# EasyEDA Pro project ProProject_Smart Flower.epro

# Schematic Schematic1
Create Date: 2024-08-19; Page Name: ESP32; Project Name: Smart Flower; Schematic Name: Schematic1; Update Date: 2024-08-20; Company: EasyEDA.com; Drawn: EasyEDA; Page Size: A4; Part Number: JLCPCB-002; Reviewed: EasyEDA; Version: V0.1
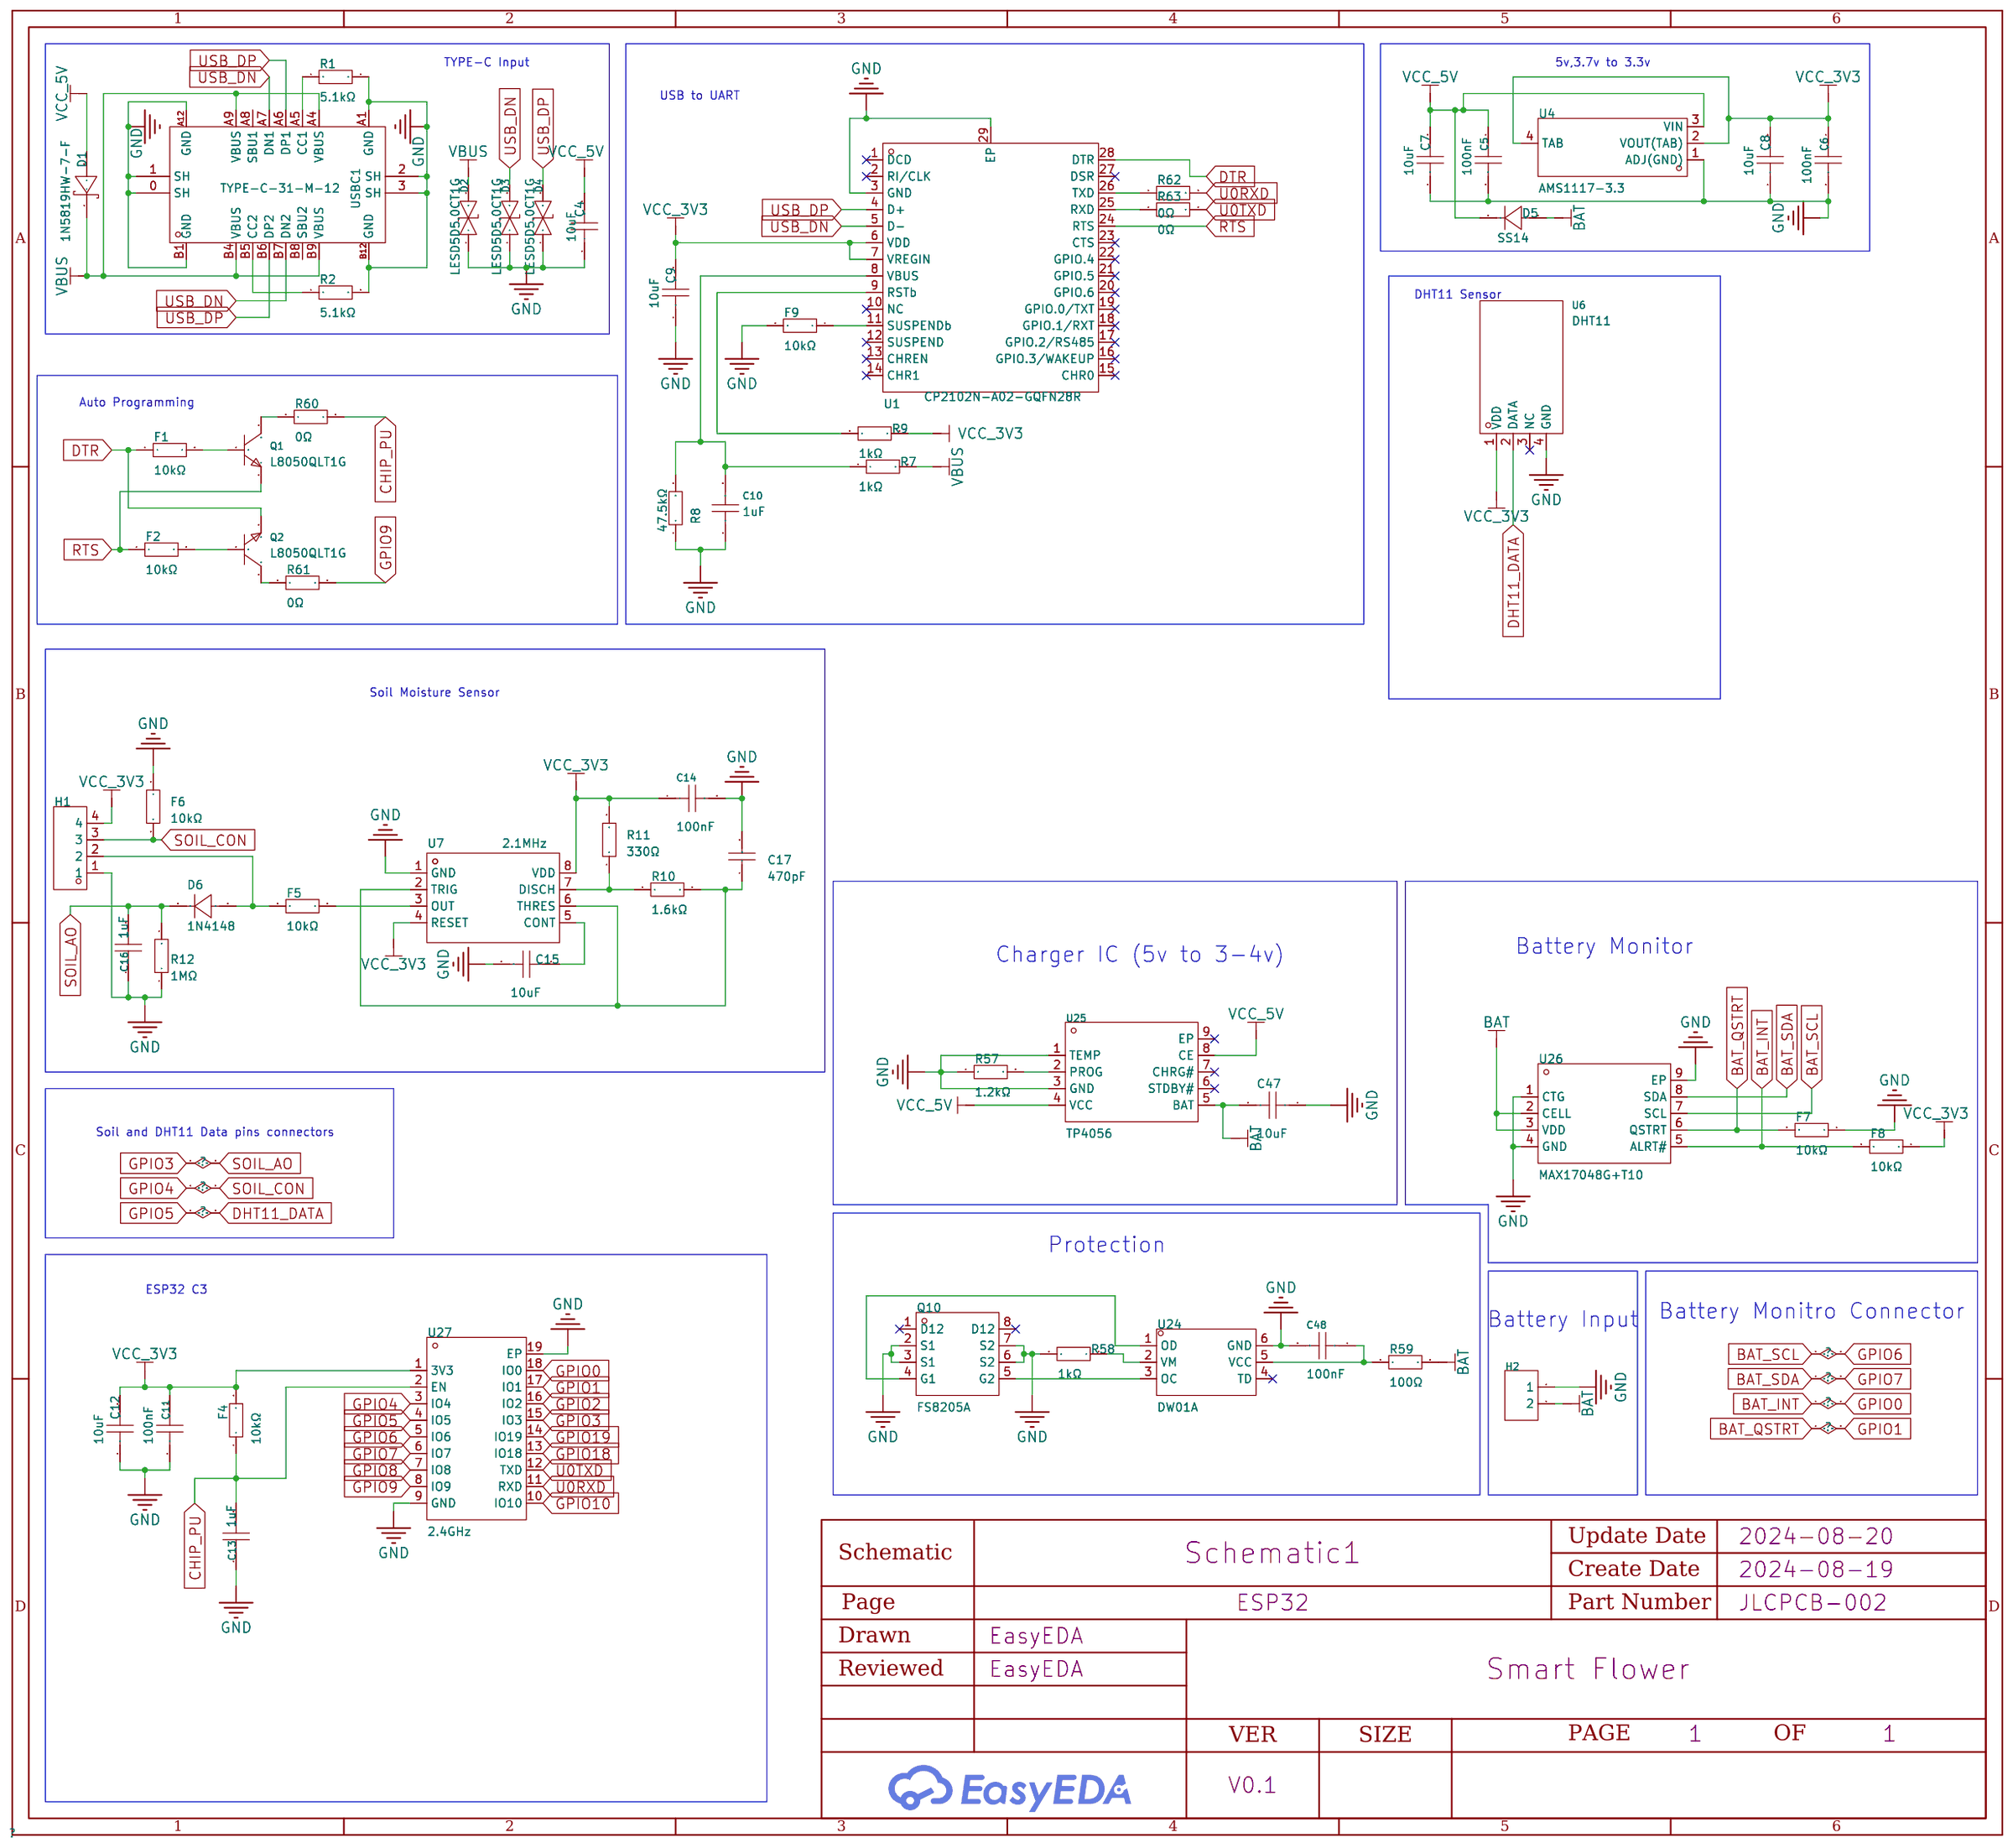
[diagram p0: schematic sheet]

## Parts
C4  10uF  [C0603]
C5  100nF  [C0805]
C6  100nF  [C0805]
C7  10uF  [C0603]
C8  10uF  [C0603]
C9  10uF  [C0603]
C10  1uF  [C0603]
C11  100nF  [C0805]
C12  10uF  [C0603]
C13  1uF  [C0603]
C14  100nF  [C0805]
C15  10uF  [C0603]
C16  1uF  [C0603]
C17  470pF  [C0603]
C47  10uF  [C0603]
C48  100nF  [C0805]
D1  1N5819HW-7-F  [SOD-123_L2.7-W1.6-LS3.7-RD]
D2  LESD5D5.0CT1G  [SOD-523_L1.2-W0.8-LS1.6-BI]
D3  LESD5D5.0CT1G  [SOD-523_L1.2-W0.8-LS1.6-BI]
D4  LESD5D5.0CT1G  [SOD-523_L1.2-W0.8-LS1.6-BI]
D5  SS14  [SMA_L4.3-W2.7-LS5.1-RD]
D6  1N4148  [DO-35_BD2.2-L4.0-D0.50_1N4148]
F1  10kΩ  [R0603]
F2  10kΩ  [R0603]
F4  10kΩ  [R0603]
F5  10kΩ  [R0603]
F6  10kΩ  [R0603]
F7  10kΩ  [R0603]
F8  10kΩ  [R0603]
F9  10kΩ  [R0603]
H1  -  [HDR-TH_4P-P2.54-V-M]  (no BOM)
H2  -  [HDR-TH_2P-P2.54-V-F]  (no BOM)
Q1  L8050QLT1G  [SOT-23-3_L2.9-W1.3-P1.90-LS2.4-BR]
Q2  L8050QLT1G  [SOT-23-3_L2.9-W1.3-P1.90-LS2.4-BR]
Q10  FS8205A  [TSSOP-8_L4.4-W3.0-P0.65-LS6.4-BL-2]  (no BOM)
R1  5.1kΩ  [R0402]
R2  5.1kΩ  [R0402]
R7  1kΩ  [R0402]
R8  47.5kΩ  [R0402]
R9  1kΩ  [R0603]
R10  1.6kΩ  [R0402]
R11  330Ω  [R0603]
R12  1MΩ  [R0603]
R57  1.2kΩ  [R0402]
R58  1kΩ  [R0603]
R59  100Ω  [R0603]
R60  0Ω  [R0402]
R61  0Ω  [R0402]
R62  0Ω  [R0402]
R63  0Ω  [R0402]
U1  CP2102N-A02-GQFN28R  [QFN-28_L5.0-W5.0-P0.50-TL-EP3.3]
U4  AMS1117-3.3  [SOT-223-4_L6.5-W3.5-P2.30-LS7.0-BR]
U6  DHT11  [SENSOR-TH_DHT11]
U7  2.1MHz  [SOIC-8_L5.0-W4.0-P1.27-LS6.0-BL]
U24  DW01A  [SOT-23-6_L2.9-W1.6-P0.95-LS2.8-BL]
U25  TP4056  [ESOP-8_L4.9-W3.9-P1.27-LS6.0-BL-EP]
U26  MAX17048G+T10  [DFN-8_L2.0-W2.0-P0.50-BL-EP]
U27  2.4GHz  [BULETM-SMD_ESPRESSIF_ESP32-C3-WROOM-02-N4-4MB]
USBC1  TYPE-C-31-M-12  [USB-C_SMD-TYPE-C-31-M-12]

## Library data of the parts
C4 C7-C9 C12 C15 C47 = CL10A106MA8NRNC: Capacitance: Tolerance:±20% Tolerance:±20% Voltage Rated: Temperature Coefficient:; LCSC Part Name: 10uF ±20% 25V; Supplier Part: C96446; Manufacturer: SAMSUNG(三星); Supplier Footprint: 0603; JLCPCB Part Class: Basic Part; Datasheet: https://atta.szlcsc.com/upload/public/pdf/source/20160218/1457707763339.pdf; Supplier: LCSC; Tolerance: ±20%
C5 C6 C11 C14 C48 = CL21B104KCFNNNE: Capacitance: Tolerance:±10% Tolerance:±10% Voltage Rated: Temperature Coefficient:; LCSC Part Name: 100nF ±10% 100V; Supplier Part: C28233; Manufacturer: SAMSUNG(三星); Supplier Footprint: 0805; JLCPCB Part Class: Basic Part; Datasheet: https://atta.szlcsc.com/upload/public/pdf/source/20160218/1457707763339.pdf; Supplier: LCSC; Tolerance: ±10%
C10 C13 C16 = CL10A105KB8NNNC: Capacitance: Tolerance:±10% Tolerance:±10% Voltage Rated: Temperature Coefficient:; LCSC Part Name: 1uF ±10% 50V; Supplier Part: C15849; Manufacturer: SAMSUNG(三星); Supplier Footprint: 0603; JLCPCB Part Class: Basic Part; Datasheet: https://atta.szlcsc.com/upload/public/pdf/source/20160218/1457707763339.pdf; Supplier: LCSC; Tolerance: ±10%
C17 = 0603B471K500NT: Capacitance: Tolerance:±10% Tolerance:±10% Voltage Rated: Temperature Coefficient:; LCSC Part Name: 470pF ±10% 50V; Supplier Part: C1620; Manufacturer: FH(风华); Supplier Footprint: 0603; JLCPCB Part Class: Basic Part; Datasheet: https://atta.szlcsc.com/upload/public/pdf/source/20200305/C486355_26A10D38EF8C2A5C37091D0039909270.pdf; Supplier: LCSC; Tolerance: ±10%
D1 = 1N5819HW-7-F: Forward Voltage (Vf@If):450mV@1A Reverse Voltage (Vr):40V Average Rectified Current (Io):1A Reverse Leakage Current (Ir):1mA@40V; LCSC Part Name: 电压:40V 电流:1A; Supplier Part: C82544; Manufacturer: DIODES(美台); Supplier Footprint: SOD-123; JLCPCB Part Class: Extended Part; Datasheet: https://atta.szlcsc.com/upload/public/pdf/source/20161024/1477288459223.pdf; Supplier: LCSC; Forward Voltage (Vf@If): 450mV@1A; Reverse Voltage (Vr): 40V; Average Rectified Current (Io): 1A; Reverse Leakage Current (Ir): 1mA@40V
D2-D4 = LESD5D5.0CT1G: polarity:Bi-Directional Reverse Stand-Off Voltage (Vrwm):5V Maximum Clamping Voltage:18.6V Peak Pulse Current (Ipp)@10/1000us:9.4A Breakdown Voltage:5.6V Type:ESD; LCSC Part Name: 双向ESD; Supplier Part: C383211; Manufacturer: LRC(乐山无线电); Supplier Footprint: SOD-523; JLCPCB Part Class: Extended Part; Datasheet: https://atta.szlcsc.com/upload/public/pdf/source/20190807/C383211_633DF4B4E2C161403226E5235FE33A1C.pdf; Supplier: LCSC; polarity: Bi-Directional; Reverse Stand-Off Voltage (Vrwm): 5V; Maximum Clamping Voltage: 18.6V; Peak Pulse Current (Ipp)@10/1000us: 9.4A; Breakdown Voltage: 5.6V; Type: ESD
D5 = SS14_C2480: Diode Configuration:Single Forward Voltage (Vf@If):550mV@1A Reverse Voltage (Vr):40V Rectified Current:1A Reverse Leakage Current (Ir):300uA@40V; LCSC Part Name: 电压:40V 电流:1A; Supplier Part: C2480; Manufacturer: MDD(辰达半导体); Supplier Footprint: SMA(DO-214AC); JLCPCB Part Class: Basic Part; Datasheet: https://atta.szlcsc.com/upload/public/pdf/source/20230712/2DB6064CFBB99DE6DB116BEE8208BE66.pdf; Supplier: LCSC; Diode Configuration: Single; Forward Voltage (Vf@If): 550mV@1A; Reverse Voltage (Vr): 40V; Rectified Current: 1A; Reverse Leakage Current (Ir): 300uA@40V; Average Rectified Current (Io): 1A; Peak forward surge current: 30A
D6 = 1N4148_C18195411: Supplier Part: C18195411; Manufacturer: LJ(朗捷); Supplier Footprint: DO-35; JLCPCB Part Class: Extended Part; Datasheet: https://atta.szlcsc.com/upload/public/pdf/source/20230921/E18EF32AEA6D96127C0687F4453A915D.pdf; Supplier: LCSC
F1 F2 F4-F9 = 0603WAF1002T5E: Type:Thick Film Resistors Resistance:10kΩ Tolerance:±1% Tolerance:±1% Power(Watts): Overload Voltage (Max): Temperature Coefficient:±100ppm/℃ Temperature Coefficient:±100ppm/℃ Operating Temperature Range:-55℃~+155℃ Operating Temperature Range:-55℃~+155℃; LCSC Part Name: 厚膜电阻 10kΩ ±1% 100mW; Supplier Part: C25804; Manufacturer: UNI-ROYAL(厚声); Supplier Footprint: 0603; JLCPCB Part Class: Basic Part; Datasheet: https://atta.szlcsc.com/upload/public/pdf/source/20200306/C422600_1E6D84923E4A46A82E41ADD87F860B5C.pdf; Supplier: LCSC; Type: Thick Film Resistors; Tolerance: ±1%; Temperature Coefficient: ±100ppm/℃; Operating Temperature Range: -55℃~+155℃
H1 = HDR-M_2.54_1x4P: Supplier Footprint: Through
H2 = HDR-F_2.54_1x2P: Supplier Footprint: Through
Q1 Q2 = L8050QLT1G: Transistor Type: Collector Current (Ic): Collector-Emitter Breakdown Voltage (Vceo): Power Dissipation (Pd):; LCSC Part Name: 耐压:25V 电流:800mA NPN; Supplier Part: C49581; Manufacturer: LRC(乐山无线电); Supplier Footprint: SOT-23; JLCPCB Part Class: Extended Part; Datasheet: https://atta.szlcsc.com/upload/public/pdf/source/20150518/1457707314424.pdf; Supplier: LCSC
Q10 = FS8205A_C16052: Type:2 N-Channel Drain Source Voltage (Vdss): Continuous Drain Current (Id): Power Dissipation (Pd): Drain Source On Resistance (RDS(on)@Vgs,Id):25mΩ@4.5V,4A Gate Threshold Voltage (Vgs(th)@Id):1V@250uA; LCSC Part Name: 2个N沟道 耐压:20V 电流:6A; Supplier Part: C16052; Manufacturer: FORTUNE(富晶); Supplier Footprint: TSSOP-8; JLCPCB Part Class: Extended Part; Datasheet: https://atta.szlcsc.com/upload/public/pdf/source/20140228/1457706997167.pdf; Supplier: LCSC; Type: 2 N-Channel; Drain Source On Resistance (RDS(on)@Vgs,Id): 25mΩ@4.5V,4A; Gate Threshold Voltage (Vgs(th)@Id): 1V@250uA
R1 R2 = 0402WGF5101TCE: Type:Thick Film Resistors Resistance:5.1kΩ Tolerance:±1% Tolerance:±1% Power(Watts): Overload Voltage (Max): Temperature Coefficient:±100ppm/℃ Temperature Coefficient:±100ppm/℃ Operating Temperature Range:-55℃~+155℃ Operating Temperature Range:-55℃~+155℃; LCSC Part Name: 5.1kΩ ±1% 62.5mW 厚膜电阻; Supplier Part: C25905; Manufacturer: UNI-ROYAL(厚声); Supplier Footprint: 0402; JLCPCB Part Class: Basic Part; Datasheet: https://atta.szlcsc.com/upload/public/pdf/source/20200306/C422600_1E6D84923E4A46A82E41ADD87F860B5C.pdf; Supplier: LCSC; Type: Thick Film Resistors; Tolerance: ±1%; Temperature Coefficient: ±100ppm/℃; Operating Temperature Range: -55℃~+155℃
R7 = 0402WGF1001TCE: Type:Thick Film Resistors Resistance:1kΩ Tolerance:±1% Tolerance:±1% Power(Watts): Overload Voltage (Max): Temperature Coefficient:±100ppm/℃ Temperature Coefficient:±100ppm/℃ Operating Temperature Range:-55℃~+155℃ Operating Temperature Range:-55℃~+155℃; LCSC Part Name: 1kΩ ±1% 62.5mW 厚膜电阻; Supplier Part: C11702; Manufacturer: UNI-ROYAL(厚声); Supplier Footprint: 0402; JLCPCB Part Class: Basic Part; Datasheet: https://atta.szlcsc.com/upload/public/pdf/source/20200306/C422600_1E6D84923E4A46A82E41ADD87F860B5C.pdf; Supplier: LCSC; Type: Thick Film Resistors; Tolerance: ±1%; Temperature Coefficient: ±100ppm/℃; Operating Temperature Range: -55℃~+155℃
R8 = AR02DTD4752: Type:Thin Film Resistor Resistance: Tolerance:±0.5% Tolerance:±0.5% Power(Watts): Overload Voltage (Max): Temperature Coefficient:±50ppm/℃ Temperature Coefficient:±50ppm/℃ Operating Temperature Range:-55℃~+155℃ Operating Temperature Range:-55℃~+155℃; LCSC Part Name: 薄膜电阻 47.5kΩ ±0.5% 62.5mW; Supplier Part: C319604; Manufacturer: Viking(光颉); Supplier Footprint: 0402; JLCPCB Part Class: Extended Part; Datasheet: https://atta.szlcsc.com/upload/public/pdf/source/20191129/C465721_10D49275DB41E427863CE9C8D788770A.pdf; Supplier: LCSC; Type: Thin Film Resistor; Tolerance: ±0.5%; Temperature Coefficient: ±50ppm/℃; Operating Temperature Range: -55℃~+155℃
R9 R58 = 0603WAF1001T5E: Type:Thick Film Resistors Resistance:1kΩ Tolerance:±1% Tolerance:±1% Power(Watts): Overload Voltage (Max): Temperature Coefficient:±100ppm/℃ Temperature Coefficient:±100ppm/℃ Operating Temperature Range:-55℃~+155℃ Operating Temperature Range:-55℃~+155℃; LCSC Part Name: 1kΩ ±1% 100mW 厚膜电阻; Supplier Part: C21190; Manufacturer: UNI-ROYAL(厚声); Supplier Footprint: 0603; JLCPCB Part Class: Basic Part; Datasheet: https://atta.szlcsc.com/upload/public/pdf/source/20200306/C422600_1E6D84923E4A46A82E41ADD87F860B5C.pdf; Supplier: LCSC; Type: Thick Film Resistors; Tolerance: ±1%; Temperature Coefficient: ±100ppm/℃; Operating Temperature Range: -55℃~+155℃
R10 = RTT02162JTH: Type:Thick Film Resistors Resistance: Tolerance:±5% Tolerance:±5% Power(Watts): Overload Voltage (Max): Temperature Coefficient:±100ppm/℃ Temperature Coefficient:±100ppm/℃ Operating Temperature Range:-55℃~+155℃ Operating Temperature Range:-55℃~+155℃; LCSC Part Name: 厚膜电阻 1.6kΩ ±5% 62.5mW; Supplier Part: C102832; Manufacturer: RALEC(旺诠); Supplier Footprint: 0402; JLCPCB Part Class: Extended Part; Datasheet: https://atta.szlcsc.com/upload/public/pdf/source/20191219/C158410_884373A5B7E1BC76BF57BC45A946C093.pdf; Supplier: LCSC; Type: Thick Film Resistors; Tolerance: ±5%; Temperature Coefficient: ±100ppm/℃; Operating Temperature Range: -55℃~+155℃
R11 = 0603WAF3300T5E: Type:Thick Film Resistors Resistance: Tolerance:±1% Tolerance:±1% Power(Watts): Overload Voltage (Max): Temperature Coefficient:±100ppm/℃ Temperature Coefficient:±100ppm/℃ Operating Temperature Range:-55℃~+155℃ Operating Temperature Range:-55℃~+155℃; LCSC Part Name: 330Ω ±1% 100mW 厚膜电阻; Supplier Part: C23138; Manufacturer: UNI-ROYAL(厚声); Supplier Footprint: 0603; JLCPCB Part Class: Basic Part; Datasheet: https://atta.szlcsc.com/upload/public/pdf/source/20200306/C422600_1E6D84923E4A46A82E41ADD87F860B5C.pdf; Supplier: LCSC; Type: Thick Film Resistors; Tolerance: ±1%; Temperature Coefficient: ±100ppm/℃; Operating Temperature Range: -55℃~+155℃
R12 = 0603WAF1004T5E: Type:Thick Film Resistors Resistance:1MΩ Tolerance:±1% Tolerance:±1% Power(Watts): Overload Voltage (Max): Temperature Coefficient:±100ppm/℃ Temperature Coefficient:±100ppm/℃ Operating Temperature Range:-55℃~+155℃ Operating Temperature Range:-55℃~+155℃; LCSC Part Name: 1MΩ ±1% 100mW 厚膜电阻; Supplier Part: C22935; Manufacturer: UNI-ROYAL(厚声); Supplier Footprint: 0603; JLCPCB Part Class: Basic Part; Datasheet: https://atta.szlcsc.com/upload/public/pdf/source/20200306/C422600_1E6D84923E4A46A82E41ADD87F860B5C.pdf; Supplier: LCSC; Type: Thick Film Resistors; Tolerance: ±1%; Temperature Coefficient: ±100ppm/℃; Operating Temperature Range: -55℃~+155℃
R57 = RC0402FR-071K2L: Type:Thick Film Resistors Resistance: Tolerance:±1% Tolerance:±1% Power(Watts): Overload Voltage (Max): Temperature Coefficient:±100ppm/℃ Temperature Coefficient:±100ppm/℃ Operating Temperature Range:-55℃~+155℃ Operating Temperature Range:-55℃~+155℃; LCSC Part Name: 厚膜电阻 1.2kΩ ±1% 62.5mW; Supplier Part: C138040; Manufacturer: YAGEO(国巨); Supplier Footprint: 0402; JLCPCB Part Class: Extended Part; Datasheet: https://atta.szlcsc.com/upload/public/pdf/source/20181009/C309620_DA5935B6E1D48212CB7A533FE518B3C2.pdf; Supplier: LCSC; Type: Thick Film Resistors; Tolerance: ±1%; Temperature Coefficient: ±100ppm/℃; Operating Temperature Range: -55℃~+155℃
R59 = 0603WAF1000T5E: Type:Thick Film Resistors Resistance: Tolerance:±1% Tolerance:±1% Power(Watts): Overload Voltage (Max): Temperature Coefficient:±200ppm/℃ Temperature Coefficient:±200ppm/℃ Operating Temperature Range:-55℃~+155℃ Operating Temperature Range:-55℃~+155℃; LCSC Part Name: 100Ω ±1% 100mW 厚膜电阻; Supplier Part: C22775; Manufacturer: UNI-ROYAL(厚声); Supplier Footprint: 0603; JLCPCB Part Class: Basic Part; Datasheet: https://atta.szlcsc.com/upload/public/pdf/source/20200306/C422600_1E6D84923E4A46A82E41ADD87F860B5C.pdf; Supplier: LCSC; Type: Thick Film Resistors; Tolerance: ±1%; Temperature Coefficient: ±200ppm/℃; Operating Temperature Range: -55℃~+155℃
R60-R63 = 0402WGF0000TCE: Type:Thick Film Resistors Resistance: Tolerance:±1% Tolerance:±1% Power(Watts): Overload Voltage (Max): Temperature Coefficient:±800ppm/℃ Temperature Coefficient:±800ppm/℃ Operating Temperature Range:-55℃~+155℃ Operating Temperature Range:-55℃~+155℃; LCSC Part Name: 0Ω ±1% 62.5mW 厚膜电阻; Supplier Part: C17168; Manufacturer: UNI-ROYAL(厚声); Supplier Footprint: 0402; JLCPCB Part Class: Basic Part; Datasheet: https://atta.szlcsc.com/upload/public/pdf/source/20200306/C422600_1E6D84923E4A46A82E41ADD87F860B5C.pdf; Supplier: LCSC; Type: Thick Film Resistors; Tolerance: ±1%; Temperature Coefficient: ±800ppm/℃; Operating Temperature Range: -55℃~+155℃
U1 = CP2102N-A02-GQFN28R: Applications Function:USB转UART Protocol:UART Supply Voltage:3V~3.6V Supply Voltage:3V~3.6V Operating Temperature:-40℃~+85℃@(Ta) Operating Temperature:-40℃~+85℃@(Ta); LCSC Part Name: USB 2.0全速功能控制器，USB收发器，振荡器和通用异步接收机/发射机(UART); Supplier Part: C964632; Manufacturer: SKYWORKS/SILICON LABS(芯科); Supplier Footprint: QFN-28-EP(5x5); JLCPCB Part Class: Extended Part; Datasheet: https://atta.szlcsc.com/upload/public/pdf/source/20201204/C964632_F2B790CC23A72455AEF523510305B30A.pdf; Supplier: LCSC; Applications Function: USB转UART; Protocol: UART; Supply Voltage: 3V~3.6V; Operating Temperature: -40℃~+85℃@(Ta)
U4 = AMS1117-3.3_C6186: Output Type: Maximum Input Voltage:- Output Voltage:3.3V Output Voltage:3.3V MAX Output Current:1A Power Supply Rejection Ratio (PSRR):72dB@(120Hz) Dropout Voltage:1.3V@(800mA) standby current:- Noise:- Feature:- Operating Temperature:- Operating Temperat; LCSC Part Name: 输出3.3V 1A; Supplier Part: C6186; Manufacturer: AMS; Supplier Footprint: SOT-223; JLCPCB Part Class: Basic Part; Datasheet: https://atta.szlcsc.com/upload/public/pdf/source/20180727/C6186_7A095716F0823C02F1997A905E26C086.pdf; Supplier: LCSC; Output Voltage: 3.3V; MAX Output Current: 1A; Power Supply Rejection Ratio (PSRR): 72dB@(120Hz); Dropout Voltage: 1.3V@(800mA); Output Polarity: Positive electrode; Number of Outputs: 1
U6 = DHT11_C117051: LCSC Part Name: DHT11  电容式传感器; Supplier Part: C117051; Manufacturer: 广州奥松; Supplier Footprint: SIP-4; JLCPCB Part Class: Extended Part; Datasheet: https://atta.szlcsc.com/upload/public/pdf/source/20170703/1499081238365.pdf; Supplier: LCSC
U7 = TLC555CDR: Frequency:2.1MHz Supply Voltage:2V~15V Supply Voltage:2V~15V Supply Current:360uA Operating Temperature:0℃~+70℃ Operating Temperature:0℃~+70℃; Supplier Part: C6986; Manufacturer: TI(德州仪器); Supplier Footprint: SOIC-8; JLCPCB Part Class: Extended Part; Datasheet: https://www.ti.com/cn/lit/gpn/tlc555; Supplier: LCSC; Supply Voltage: 2V~15V; Supply Current: 360uA; Operating Temperature: 0℃~+70℃
U24 = DW01A_C351410: Supplier Part: C351410; Manufacturer: PUOLOP(迪浦); Supplier Footprint: SOT-23-6L; JLCPCB Part Class: Extended Part; Datasheet: https://atta.szlcsc.com/upload/public/pdf/source/20190109/C351410_3E9B9491D1909DF24C48D1B9CD871392.pdf; Supplier: LCSC
U25 = TP4056_C382139: LCSC Part Name: 1A锂电池充电IC; Supplier Part: C382139; Manufacturer: TPOWER(天源); Supplier Footprint: ESOP-8; JLCPCB Part Class: Extended Part; Datasheet: https://atta.szlcsc.com/upload/public/pdf/source/20190327/C382139_EC85960E6FE3E26856C240C81751A184.pdf; Supplier: LCSC
U26 = MAX17048G+T10: The Chip Type:电池监测芯片 Type of Battery:锂离子/Polymer Number of Cells:1 Number of Cells:1 Operating Temperature:-20℃~+70℃ Operating Temperature:-20℃~+70℃; Supplier Part: C2682616; Manufacturer: ADI(亚德诺)/MAXIM(美信); Supplier Footprint: DFN-8-EP(2x2); JLCPCB Part Class: Extended Part; Datasheet: https://atta.szlcsc.com/upload/public/pdf/source/20210106/C2682616_818568B5D3BA4B627110FCAA33E0BFB1.pdf; Supplier: LCSC; The Chip Type: 电池监测芯片; Type of Battery: 锂离子/Polymer; Number of Cells: 1; Operating Temperature: -20℃~+70℃
U27 = ESP32-C3-WROOM-02-N4_C2934560: Core Processor:ESP32-C3芯片 Support Interface:I2C；GPIO；SPI；JTAG；UART；USB；I2S Frequency:2.4GHz Output Power:20.5dBm Output Power:20.5dBm; LCSC Part Name: ESP32-C3-WROOM-02-N4; Supplier Part: C2934560; Manufacturer: ESPRESSIF(乐鑫); Manufacturer Part: ESP32-C3-WROOM-02-N4; Supplier Footprint: VFQFN-32-EP; JLCPCB Part Class: Extended Part; Datasheet: https://atta.szlcsc.com/upload/public/pdf/source/20220106/F07459EFFE1D7CBA94B4FB8A075146A6.pdf; Supplier: LCSC; Core Processor: ESP32-C3芯片; Support Interface: I2C；GPIO；SPI；JTAG；UART；USB；I2S; Output Power: 20.5dBm
USBC1 = TYPE-C-31-M-12: Connector Type:Type-C Standard:- Gender:Female Number of Ports:1 Number of Contacts:16P Mounting Style:- Current Rating - Power (Max):5A Contact Material:- Contact Plating:- Operating Temperature Range:- Operating Temperature Range:- Soldering Temperature; LCSC Part Name: Type-C 母; Supplier Part: C165948; Manufacturer: 韩国韩荣; Supplier Footprint: SMD; JLCPCB Part Class: Extended Part; Datasheet: https://atta.szlcsc.com/upload/public/pdf/source/20220525/466408E853115E789EDB0DDC29077C05.pdf; Supplier: LCSC; Connector Type: Type-C; Gender: Female; Number of Ports: 1; Number of Contacts: 16P; Current Rating - Power (Max): 5A

## Nets
GND: C4.1 C5.2 C6.2 C7.1 C8.1 C9.1 C10.1 C11.2 C12.1 C13.1 C14.2 C15.2 C16.1 C17.2 C47.1 C48.2 D2.1 D3.1 D4.1 F6.1 F7.1 F9.2 H1.1 H2.1 Q10.2(S1) Q10.3(S1) Q10.6(S2) Q10.7(S2) R1.2 R2.2 R8.1 R12.1 R57.1 R58.2 U1.3(GND) U1.29(EP) U4.1(ADJ(GND)) U6.4(GND) U7.1(GND) U24.6(GND) U25.1(TEMP) U25.3(GND) U26.1(CTG) U26.4(GND) U26.9(EP) U27.9(GND) U27.19(EP) USBC1.0(SH) USBC1.1(SH) USBC1.2(SH) USBC1.3(SH) USBC1.A1(GND) USBC1.A12(GND) USBC1.B1(GND) USBC1.B12(GND)
VBUS: D1.1(K) D2.2 R7.2 USBC1.A4(VBUS) USBC1.A9(VBUS) USBC1.B4(VBUS) USBC1.B9(VBUS)
VCC_3V3: C6.1 C8.2 C9.2 C11.1 C12.2 C14.1 F4.2 F8.1 H1.4 R9.1 R11.2 U1.6(VDD) U1.7(VREGIN) U4.2(VOUT(TAB)) U4.4(TAB) U6.1(VDD) U7.4(RESET) U7.8(VDD) U27.1(3V3)
VCC_5V: C4.2 C5.1 C7.2 D1.2(A) D5.1(K) U4.3(VIN) U25.4(VCC) U25.8(CE)
BAT: C47.2 D5.2(A) H2.2 R59.2 U25.5(BAT) U26.2(CELL) U26.3(VDD)
BAT_INT: F8.2 U26.5(ALRT#) U27.18(IO0)
BAT_QSTRT: F7.2 U26.6(QSTRT) U27.17(IO1)
BAT_SCL: U26.7(SCL) U27.5(IO6)
BAT_SDA: U26.8(SDA) U27.6(IO7)
CHIP_PU: C13.2 F4.1 R60.2 U27.2(EN)
DHT11_DATA: U6.2(DATA) U27.4(IO5)
DTR: F1.1 Q2.2(E) U1.28(DTR)
GPIO2: U27.16(IO2)
GPIO3: C16.2 D6.2(C) R12.2 U27.15(IO3)
GPIO4: F6.2 H1.3 U27.3(IO4)
GPIO8: U27.7(IO8)
GPIO9: R61.2 U27.8(IO9)
GPIO10: U27.10(IO10)
GPIO18: U27.13(IO18)
GPIO19: U27.14(IO19)
RTS: F2.1 Q1.2(E) U1.24(RTS)
U0RXD: R62.2 U27.11(RXD)
U0TXD: R63.2 U27.12(TXD)
USB_DN: D3.2 U1.5(D-) USBC1.A7(DN1) USBC1.B7(DN2)
USB_DP: D4.2 U1.4(D+) USBC1.A6(DP1) USBC1.B6(DP2)
$1N9728: R2.1 USBC1.B5(CC2)
$1N9740: R1.1 USBC1.A5(CC1)
$1N10217: Q1.3(C) R60.1
$1N10218: Q2.3(C) R61.1
$1N10219: F1.2 Q1.1(B)
$1N10220: F2.2 Q2.1(B)
$1N12006: R63.1 U1.25(RXD)
$1N12008: R62.1 U1.26(TXD)
$1N12116: F9.1 U1.11(SUSPENDb)
$1N12546: R9.2 U1.9(RSTb)
$1N16421: C15.1 U7.5(CONT)
$1N16436: R10.1 R11.1 U7.7(DISCH)
$1N16545: F5.1 U7.3(OUT)
$1N16696: D6.1(A) F5.2 H1.2
$1N16851: C17.1 R10.2 U7.2(TRIG) U7.6(THRES)
$1N49000: R57.2 U25.2(PROG)
$1N49009: C48.1 R59.1 U24.5(VCC)
$1N49011: Q10.5(G2) U24.3(OC)
$1N49012: Q10.4(G1) U24.1(OD)
$1N49015: R58.1 U24.2(VM)
Net-(C10-2): C10.2 R7.1 R8.2 U1.8(VBUS)

Not connected (* = marked no-connect by the designer): Q10 1(D12)* 8(D12)*; U1 1(DCD)* 2(RI/CLK)* 10(NC)* 12(SUSPEND)* 13(CHREN)* 14(CHR1)* 15(CHR0)* 16(GPIO.3/WAKEUP)* 17(GPIO.2/RS485)* 18(GPIO.1/RXT)* 19(GPIO.0/TXT)* 20(GPIO.6)* 21(GPIO.5)* 22(GPIO.4)* 23(CTS)* 27(DSR)*; U6 3(NC)*; U24 4(TD)*; U25 6(STDBY#)* 7(CHRG#)* 9(EP)*; USBC1 A8(SBU1) B8(SBU2)

## Notes on the sheet
- TYPE-C Input
- 5v,3.7v to 3.3v
- USB to UART
- DHT11 Sensor
- Auto Programming
- Soil Moisture Sensor
- Charger IC (5v to 3-4v)
- Battery Monitor
- Soil and DHT11 Data pins connectors
- Protection
- ESP32 C3
- Battery Monitro Connector
- Battery Input

# Board PCB19
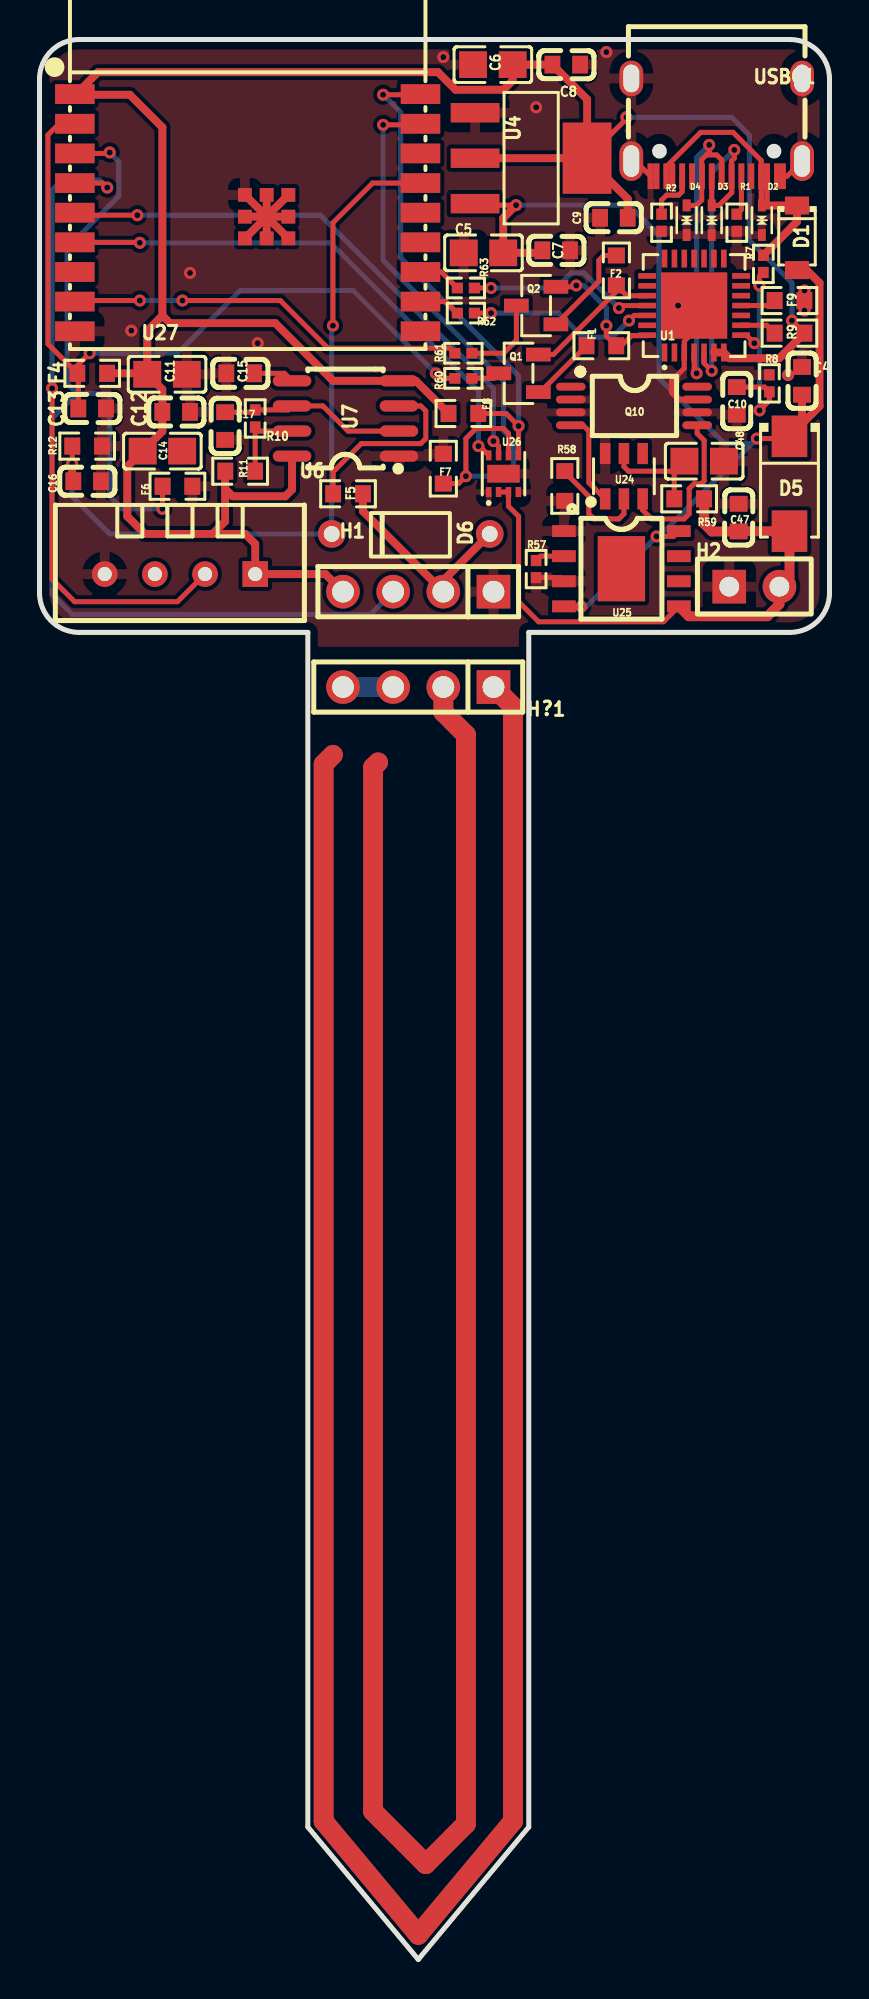
[diagram p1: board, top side]
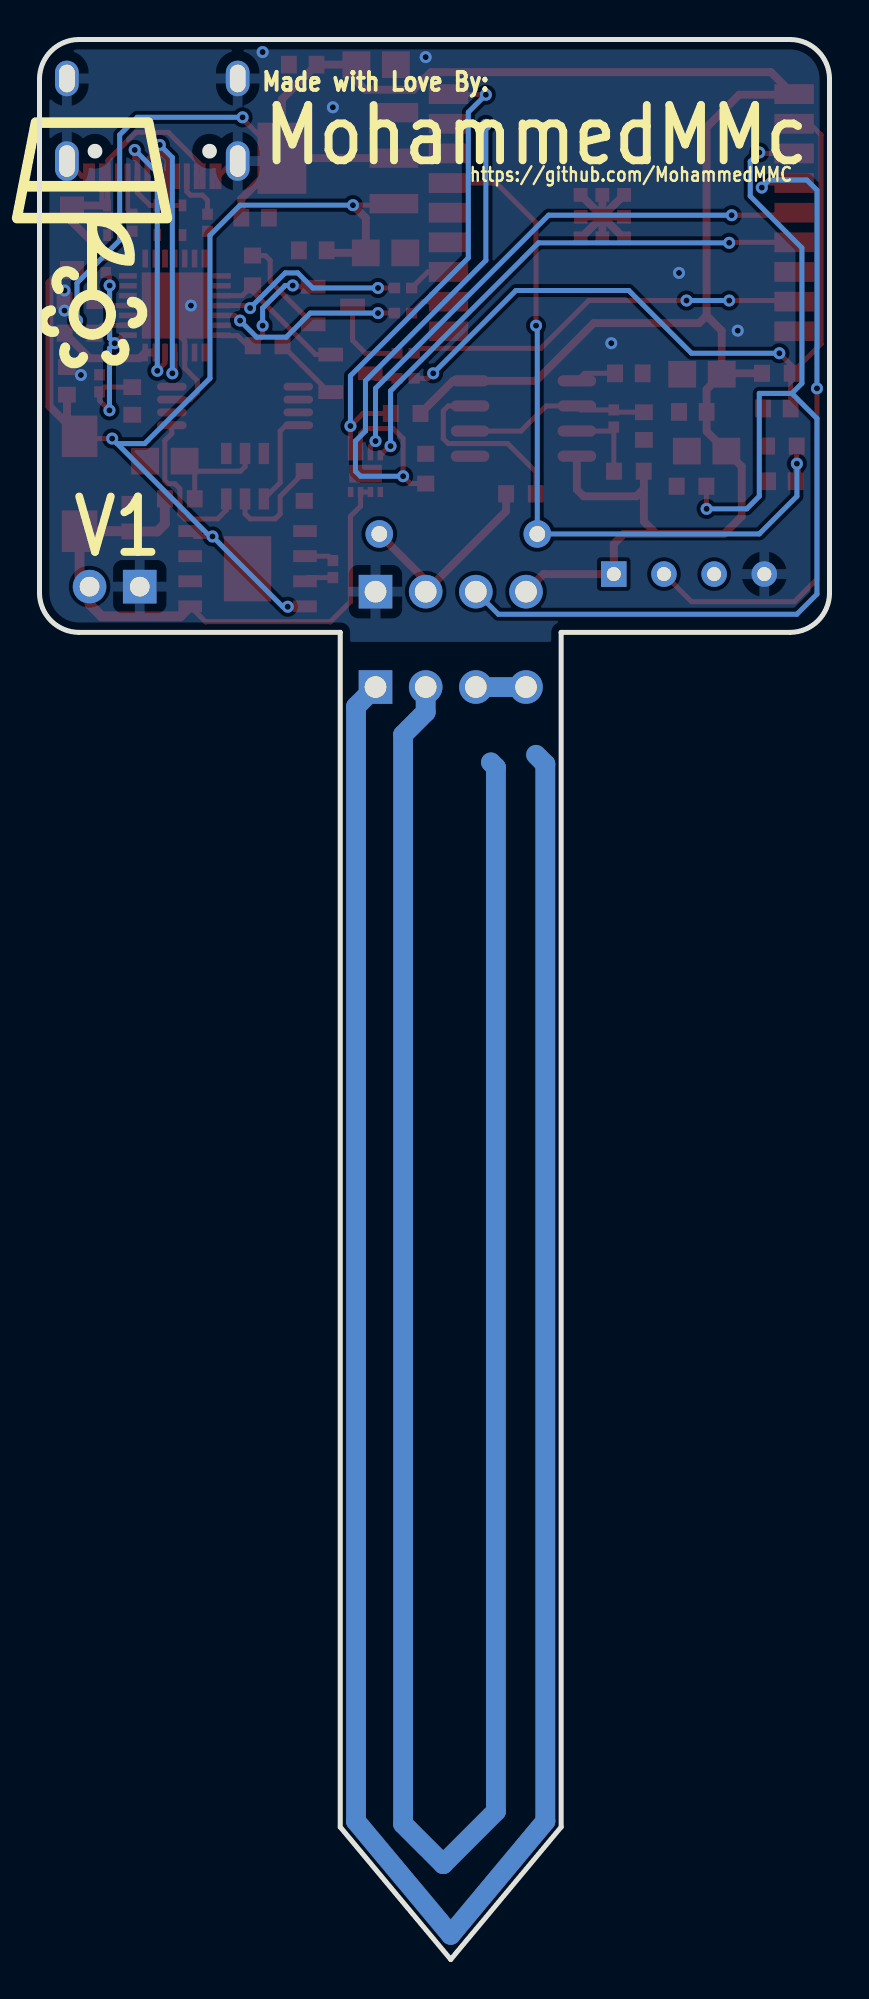
[diagram p2: board, bottom side, seen from below]

Outline 40 x 97.16 mm; copper layers: Top Layer, Bottom Layer. Coordinates in mm from the lower left corner of the outline.
Outline path: 0,95.16 0,69.15 arc(0.59,67.74) 2,67.15 13.59,67.15 13.59,6.7 19.18,0 24.77,6.7 24.77,67.15 38,67.15 arc(39.41,67.74) 40,69.15 40,95.16 arc(39.41,96.57) 38,97.16 2,97.16 arc(0.59,96.57) 0,95.16
Stack: Top Layer 0.035mm / Dielectric1 1.51mm FR4 er 4.5 / Bottom Layer 0.035mm

## Design rules (mm)
template: JLCPCB Capability(Two Layers Board)
spacing copperThickness1oz (default): track to track 0.102, other pairs 0.152 to 0.3
spacing copperThickness2oz: track to track 0.203, other pairs 0.152 to 0.3
track width copperThickness1oz (default): min 0.127, default 0.254, max 2.54
track width copperThickness2oz: min 0.203, default 0.254, max 2.54
differential pair differentialPair (default): width min 0.127, default 0.254, max 2.54; gap min 0.152, default 0.152
via viaSize (default): diameter min 0.5, default 0.61, max 10; hole min 0.3, default 0.305, max 6.3

## Placement (name value [footprint] x y rotation side)
C4  10uF  [C0603]  38.61 79.88 270 top
C5  100nF  [C0805]  22.48 86.36 180 top
C6  100nF  [C0805]  22.95 95.88 180 top
C7  10uF  [C0603]  26.16 86.49 180 top
C8  10uF  [C0603]  26.67 95.88 180 top
C9  10uF  [C0603]  29.08 88.14 0 top
C10  1uF  [C0603]  35.31 78.87 90 top
C11  100nF  [C0805]  6.46 80.21 0 top
C12  10uF  [C0603]  6.92 78.31 180 top
C13  1uF  [C0603]  2.67 78.49 180 top
C14  100nF  [C0805]  6.22 76.33 0 top
C15  10uF  [C0603]  10.16 80.26 180 top
C16  1uF  [C0603]  2.41 74.8 180 top
C17  470pF  [C0603]  9.4 77.6 270 top
C47  10uF  [C0603]  35.4 72.96 270 top
C48  100nF  [C0805]  33.66 75.82 0 top
D1  1N5819HW-7-F  [SOD-123_L2.7-W1.6-LS3.7-RD]  38.35 87.12 270 top
D2  LESD5D5.0CT1G  [SOD-523_L1.2-W0.8-LS1.6-BI]  36.58 88.01 90 top
D3  LESD5D5.0CT1G  [SOD-523_L1.2-W0.8-LS1.6-BI]  34.04 88.01 90 top
D4  LESD5D5.0CT1G  [SOD-523_L1.2-W0.8-LS1.6-BI]  32.77 88.01 90 top
D5  SS14  [SMA_L4.3-W2.7-LS5.1-RD]  37.97 74.68 270 top
D6  1N4148  [DO-35_BD2.2-L4.0-D0.50_1N4148]  18.8 72.14 180 top
F1  10kΩ  [R0603]  28.45 81.66 180 top
F2  10kΩ  [R0603]  29.21 85.47 90 top
F4  10kΩ  [R0603]  2.67 80.26 0 top
F5  10kΩ  [R0603]  15.62 74.17 0 top
F6  10kΩ  [R0603]  6.98 74.55 180 top
F7  10kΩ  [R0603]  20.45 75.44 270 top
F8  10kΩ  [R0603]  21.46 78.23 0 top
F9  10kΩ  [R0603]  37.97 83.95 0 top
H1  -  [HDR-TH_4P-P2.54-V-M]  19.18 69.21 180 top
H2  -  [HDR-TH_2P-P2.54-V-F]  36.19 69.47 0 top
H？1  -  [HDR-TH_4P-P2.54-V-F]  19.18 64.39 180 top
Q1  L8050QLT1G  [SOT-23-3_L2.9-W1.3-P1.90-LS2.4-BR]  24.26 80.26 0 top
Q2  L8050QLT1G  [SOT-23-3_L2.9-W1.3-P1.90-LS2.4-BR]  25.15 83.69 0 top
Q10  FS8205A  [TSSOP-8_L4.4-W3.0-P0.65-LS6.4-BL-2]  30.1 78.61 270 top
R1  5.1kΩ  [R0402]  35.31 87.88 270 top
R2  5.1kΩ  [R0402]  31.5 87.88 270 top
R7  1kΩ  [R0402]  36.65 85.8 270 top
R8  47.5kΩ  [R0402]  36.96 79.76 270 top
R9  1kΩ  [R0603]  37.97 82.3 180 top
R10  1.6kΩ  [R0402]  10.92 77.98 90 top
R11  330Ω  [R0603]  10.16 75.31 180 top
R12  1MΩ  [R0603]  2.41 76.58 180 top
R57  1.2kΩ  [R0402]  25.15 70.36 90 top
R58  1kΩ  [R0603]  26.6 74.56 270 top
R59  100Ω  [R0603]  32.89 73.91 0 top
R60  0Ω  [R0402]  21.46 80.01 180 top
R61  0Ω  [R0402]  21.46 81.28 180 top
R62  0Ω  [R0402]  21.59 83.31 180 top
R63  0Ω  [R0402]  21.59 84.58 180 top
U1  CP2102N-A02-GQFN28R  [QFN-28_L5.0-W5.0-P0.50-TL-EP3.3]  33.15 83.69 90 top
U4  AMS1117-3.3  [SOT-223-4_L6.5-W3.5-P2.30-LS7.0-BR]  24.89 91.15 180 top
U6  DHT11  [SENSOR-TH_DHT11]  7.11 70.1 180 top
U7  2.1MHz  [SOIC-8_L5.0-W4.0-P1.27-LS6.0-BL]  15.49 77.98 90 top
U24  DW01A  [SOT-23-6_L2.9-W1.6-P0.95-LS2.8-BL]  29.59 75.06 0 top
U25  TP4056  [ESOP-8_L4.9-W3.9-P1.27-LS6.0-BL-EP]  29.46 70.38 270 top
U26  MAX17048G+T10  [DFN-8_L2.0-W2.0-P0.50-BL-EP]  23.49 75.18 0 top
U27  2.4GHz  [BULETM-SMD_ESPRESSIF_ESP32-C3-WROOM-02-N4-4MB]  10.54 88.39 0 top
USBC1  TYPE-C-31-M-12  [USB-C_SMD-TYPE-C-31-M-12]  34.29 92.71 180 top

## Footprints (pads in the part's own frame, mm; a bottom-side part is the same pattern mirrored in y, then rotated)
BULETM-SMD_ESPRESSIF_ESP32-C3-WROOM-02-N4-4MB
  rect 2x1 smd: 1(-8.75,6) 2(-8.75,4.5) 3(-8.75,3) 4(-8.75,1.5) 5(-8.75,0) 6(-8.75,-1.5) 7(-8.75,-3) 8(-8.75,-4.5) 9(-8.75,-6) 10(8.75,-6) 11(8.75,-4.5) 12(8.75,-3) 13(8.75,-1.5) 14(8.75,0) 15(8.75,1.5) 16(8.75,3) 17(8.75,4.5) 18(8.75,6)
  rect 0.7x0.7 smd: 19(-0.14,0.9) 19(-0.14,-0.2) 19(-0.14,-1.3) 19(0.96,0.9) 19(0.96,-0.2) 19(0.96,-1.3) 19(2.06,0.9) 19(2.06,-0.2) 19(2.06,-1.3)
C0603
  rect 0.8x0.9 smd: 1(-0.7,0) 2(0.7,0)
C0805
  rect 1.41x1.35 smd: 1(-1,0) 2(1,0)
DFN-8_L2.0-W2.0-P0.50-BL-EP
  rect 0.28x0.505 smd: 1(-0.75,-0.927) 2(-0.25,-0.927) 3(0.25,-0.927) 4(0.75,-0.927) 5(0.75,0.927) 6(0.25,0.927) 7(-0.25,0.927) 8(-0.75,0.927)
  rect 1.65x0.9 smd: 9(0,0)
DO-35_BD2.2-L4.0-D0.50_1N4148
  round 1.4 hole 0.8: 1(-4,0) 2(4,0)
ESOP-8_L4.9-W3.9-P1.27-LS6.0-BL-EP
  rect 0.6x1.2 smd: 1(-1.905,-2.909) 2(-0.635,-2.909) 3(0.635,-2.909) 4(1.905,-2.909) 5(1.905,2.909) 6(0.635,2.909) 7(-0.635,2.909) 8(-1.905,2.909)
  rect 3.3x2.4 smd: 9(0,0)
HDR-TH_2P-P2.54-V-F
  rect 1.7x1.7 hole 1: 1(-1.27,0)
  round 1.7 hole 1: 2(1.27,0)
HDR-TH_4P-P2.54-V-F
  rect 1.7x1.7 hole 1.1: 1(-3.81,0)
  round 1.7 hole 1.1: 2(-1.27,0) 3(1.27,0) 4(3.81,0)
HDR-TH_4P-P2.54-V-M
  rect 1.7x1.7 hole 1.1: 1(-3.81,0)
  round 1.7 hole 1.1: 2(-1.27,0) 3(1.27,0) 4(3.81,0)
QFN-28_L5.0-W5.0-P0.50-TL-EP3.3
  rect 0.905x0.28 smd: 1(-2.377,1.5) 2(-2.377,1) 3(-2.377,0.5) 4(-2.377,0) 5(-2.377,-0.5) 6(-2.377,-1) 7(-2.377,-1.5) 15(2.377,-1.5) 16(2.377,-1) 17(2.377,-0.5) 18(2.377,0) 19(2.377,0.5) 20(2.377,1) 21(2.377,1.5)
  rect 0.28x0.905 smd: 8(-1.5,-2.377) 9(-1,-2.377) 10(-0.5,-2.377) 11(0,-2.377) 12(0.5,-2.377) 13(1,-2.377) 14(1.5,-2.377) 22(1.5,2.377) 23(1,2.377) 24(0.5,2.377) 25(0,2.377) 26(-0.5,2.377) 27(-1,2.377) 28(-1.5,2.377)
  rect 3.35x3.35 smd: 29(0,0)
R0402
  rect 0.566x0.54 smd: 1(-0.433,0) 2(0.433,0)
R0603
  rect 0.806x0.864 smd: 1(-0.753,0) 2(0.753,0)
SENSOR-TH_DHT11
  rect 1.296x1.296 hole 0.711: 1(-3.81,0)
  round 1.296 hole 0.711: 2(-1.27,0) 3(1.27,0) 4(3.81,0)
SMA_L4.3-W2.7-LS5.1-RD
  rect 2.1x1.8 smd: 1(-2.4,0) 2(2.4,0)
SOD-123_L2.7-W1.6-LS3.7-RD
  rect 0.91x1.22 smd: 1(-1.635,0) 2(1.635,0)
SOD-523_L1.2-W0.8-LS1.6-BI
  rect 0.6x0.4 smd: 1(-0.75,0) 2(0.75,0)
SOIC-8_L5.0-W4.0-P1.27-LS6.0-BL
  oval 0.569x1.95 smd: 1(-1.905,-2.705) 2(-0.635,-2.705) 3(0.635,-2.705) 4(1.905,-2.705) 5(1.905,2.705) 6(0.635,2.705) 7(-0.635,2.705) 8(-1.905,2.705)
SOT-23-3_L2.9-W1.3-P1.90-LS2.4-BR
  rect 1.25x0.7 smd: 1(1,-0.95) 2(1,0.95) 3(-1,0)
SOT-23-6_L2.9-W1.6-P0.95-LS2.8-BL
  rect 0.532x1.072 smd: 1(-0.95,-1.149) 2(0,-1.149) 3(0.95,-1.149) 4(0.95,1.149) 5(0,1.149) 6(-0.95,1.149)
SOT-223-4_L6.5-W3.5-P2.30-LS7.0-BR
  rect 2.47x0.98 smd: 1(2.835,-2.3) 2(2.835,0) 3(2.835,2.3)
  rect 2.47x3.6 smd: 4(-2.835,0)
TSSOP-8_L4.4-W3.0-P0.65-LS6.4-BL-2
  oval 0.4x1.5 smd: 1(-0.975,-3.2) 2(-0.325,-3.2) 3(0.325,-3.2) 4(0.976,-3.2) 5(0.976,3.2) 6(0.325,3.2) 7(-0.325,3.2) 8(-0.975,3.2)
USB-C_SMD-TYPE-C-31-M-12
  oval 1.2x2 hole 0.8x1.6: 0(-4.325,1.706) 1(4.325,1.706)
  oval 1.2x1.8 hole 0.8x1.4: 2(4.325,-2.474) 3(-4.325,-2.474)
  rect 0.3x1.3 smd: A1(-3.35,2.474) A4(-2.55,2.474) A5(-1.25,2.474) A6(-0.25,2.474) A7(0.25,2.474) A8(1.25,2.474) A9(2.55,2.474) A12(3.35,2.474) B1(3.05,2.474) B4(2.25,2.474) B5(1.75,2.474) B6(0.75,2.474) B7(-0.75,2.474) B8(-1.75,2.474) B9(-2.25,2.474) B12(-3.05,2.474)

## Nets
As in the schematic, except:
VBUS: D1.1 D2.2 R7.1 USBC1.A4 USBC1.A9 USBC1.B4 USBC1.B9
$1N12435: C10.2 R7.2 R8.2 U1.8

Pads without a net: H？1 1 2 3 4; Q10 1 8; U1 1 2 10 12 13 14 15 16 17 18 19 20 21 22 23 27; U6 3; U24 4; U25 6 7 9; USBC1 A8 B8

## Via types
v1: diameter 0.61, hole 0.305, Top Layer to Bottom Layer, 47 vias

## Routing (per net, layer and track width the routed paths; a pad name or vN(x,y) marks a point on that pad's centre or on a via; arc(x,y) is an arc through that point)
GND: length 21.6
  Top Layer w0.254: U1.29 33.15,82.39 32.65,81.89 U1.3 32.65,80.53 32,79.88 32,79.28 32.35,78.94 Q10.7 ; USBC1.0 37.85,90.24 USBC1.A1 USBC1.B12 ; USBC1.B1 USBC1.A12 30.17,91 USBC1.1 ; U25.3 26.37,69.92 25.15,69.92
  Top Layer w0.4: U27.19 U27.19 ; U27.19 U27.19 ; U27.19 U27.19 ; U27.19 U27.19 ; U27.19 U27.19 ; U27.19 U27.19 ; U27.19 U27.19 ; U27.19 U27.19
  vias: v1(4.65,82.42) v1(7.62,85.34) v1(11.05,81.79) v1(20.45,96.27) v1(25.15,93.73) v1(28.7,96.52) v1(32.33,83.69) v1(37.9,80.18) v1(38.73,84.45) v1(38.73,83.44)
VBUS: length 17.7
  Top Layer w0.254: D2.2 36.54,88.8 USBC1.B9 ; D2.2 36.58,88.76 36.58,88.76 ; D2.2 36.58,88.76 ; USBC1.A4 36.58,89.98 36.58,88.76 ; USBC1.A4 USBC1.B9 ; USBC1.A4 36.84,89.02 36.58,88.76 ; USBC1.B9 36.54,91.03 35.12,92.46 33.48,92.46 31.74,90.72 USBC1.A9 USBC1.B4
  Top Layer w0.4: 36.58,88.76 D1.1 38.35,87.94 R7.1
VCC_3V3: length 133.9
  Top Layer w0.254: v1(29.72,93.22) 29.72,93.14 U4.4 ; v1(38.1,82.93) 38.1,82.92 R9.1
  Top Layer w0.4: 6.22,83.18 6.6,82.8 11.94,82.8 14.86,79.88 19.06,79.88 F8.1 ; 6.22,83.18 6.22,92.71 4.57,94.36 1.82,94.36 ; 6.22,83.18 5.46,82.42 C11.1 ; 9.4,74.42 9.78,74.04 12.45,74.04 12.79,74.38 U7.8 ; 9.4,74.42 9.4,75.3 R11.2 ; 9.4,74.42 9.4,72.77 8.76,72.14 ; C11.1 6.22,79.45 C12.2 6.22,77.32 C14.1 4.44,75.55 4.44,73.02 5.33,72.14 8.76,72.14 ; C11.1 5.41,80.26 F4.2 ; 1.82,94.36 2.97,95.5 20.18,95.5 21.07,94.61 23.49,94.61 23.95,95.07 C6.1 C8.2 27.73,94.13 U4.4 ; 1.82,94.36 U27.1 ; 8.76,72.14 10.41,72.14 10.92,71.63 U6.1 14.48,70.1 H1.4 ; U4.4 29.78,89.09 C9.2 ; U4.4 U4.2 ; R9.1 37.46,81.03 34.94,81.03 U1.7 U1.6
  Bottom Layer w0.254: v1(38.1,82.93) 38.1,84.84 35.94,86.99 35.94,92.33 35.05,93.22 v1(29.72,93.22)
VCC_5V: length 55.5
  Top Layer w0.254: U25.4 26.57,68.45 v1(27.43,68.45) ; U4.3 22.13,88.77 v1(24.13,88.77) ; U25.8 32.1,72.01 v1(31.24,72.01) ; v1(36.32,76.96) 37.86,76.96 D5.1
  Top Layer w0.4: 38.61,77.71 39.5,78.6 39.5,84.84 38.85,85.49 D1.2 ; 38.61,77.71 C4.2 ; 38.61,77.71 D5.1 ; v1(24.13,88.77) 23.48,88.12 C5.1 25.33,86.36 C7.2
  Bottom Layer w0.254: 36.07,76.71 34.67,76.71 31.37,80.01 31.37,87.25 29.84,88.77 v1(24.13,88.77) ; 36.07,76.71 v1(36.32,76.96) ; 36.07,76.71 31.37,72.01 v1(31.24,72.01) 27.69,68.45 v1(27.43,68.45)
(no net): length 492.1
  Top Layer w1: 17.14,60.58 16.89,60.32 16.89,7.49 19.56,4.83 21.59,6.86 21.59,61.98 20.45,63.12 H？1.2 ; 14.86,60.96 14.39,60.49 14.39,6.99 19.18,1.25 23.97,6.99 23.97,63.4 H？1.1
  Bottom Layer w1: H？1.2 20.45,63.12 21.59,61.98 21.59,6.86 19.56,4.83 16.89,7.49 16.89,60.32 17.14,60.58 ; 14.86,60.96 14.39,60.49 14.39,6.99 19.18,1.25 23.97,6.99 23.97,63.4 H？1.1 ; H？1.4 H？1.3
BAT: length 30.3
  Top Layer w0.254: U26.2 U26.3 23.74,73.54 24.26,73.02 24.26,68.71 25.27,67.69 31.59,67.69 U25.5
  Top Layer w0.5: R59.2 33.66,73.91 33.66,72.64 34.04,72.26 C47.2 35.41,72.28 D5.2 37.97,69.98 H2.2 37.47,68.58 36.86,67.97 32.87,67.97 U25.5
BAT_INT: length 25.3
  Top Layer w0.254: U26.5 24.26,76.12 v1(24.26,77.6) 23.62,78.23 F8.2 ; U27.18 19.26,94.36 v1(17.4,94.36)
  Bottom Layer w0.254: v1(17.4,94.36) 18.29,93.47 18.29,86.11 24.26,80.14 v1(24.26,77.6)
BAT_QSTRT: length 31.5
  Top Layer w0.254: U26.6 23.75,76.12 23.75,77.22 23.49,77.47 22.1,77.47 21.59,76.96 v1(21.59,75.06) 21.22,74.68 F7.2 ; U27.17 19.24,92.84 v1(17.4,92.84)
  Bottom Layer w0.254: v1(21.59,75.06) 23.75,75.06 24,75.31 24,76.83 23.49,77.34 23.49,79.88 17.4,85.98 v1(17.4,92.84)
BAT_SCL: length 28.4
  Top Layer w0.254: v1(4.95,88.26) 1.92,88.26 U27.5 ; U26.7 23.24,76.58 v1(22.99,76.83)
  Bottom Layer w0.254: v1(22.99,76.83) 22.99,79.5 14.22,88.26 v1(4.95,88.26)
BAT_SDA: length 27.1
  Top Layer w0.254: v1(22.22,76.58) 22.28,76.58 U26.8 ; v1(5.08,86.87) 5.06,86.89 U27.6
  Bottom Layer w0.254: v1(22.22,76.58) 22.22,79.37 14.73,86.87 v1(5.08,86.87)
CHIP_PU: length 39
  Top Layer w0.254: F4.1 0.43,81.75 0.43,92.33 0.99,92.89 U27.2 ; F4.1 1.91,80.65 v1(2.54,81.28) ; F4.1 1.97,80.21 1.97,78.49 ; v1(20.07,80.26) 20.32,80.01 R60.2
  Bottom Layer w0.254: v1(20.07,80.26) 15.88,84.45 10.16,84.45 6.98,81.28 v1(2.54,81.28)
DHT11_DATA: length 33.4
  Top Layer w0.254: U6.2 6.98,68.71 1.78,68.71 0.63,69.85 v1(0.63,79.5) ; U27.4 3.2,89.89 v1(3.43,89.66)
  Bottom Layer w0.254: v1(0.63,79.5) 0.63,89.53 1.14,90.04 3.05,90.04 v1(3.43,89.66)
DTR: length 7
  Top Layer w0.254: 26.15,84.64 27.11,84.64 v1(27.18,84.71) ; U1.28 30.75,82.17 29.97,82.17 29.46,81.66 F1.1 28.7,82.16 v1(28.7,82.68)
  Bottom Layer w0.254: v1(28.7,82.68) 28.7,83.57 27.56,84.71 v1(27.18,84.71)
GPIO3: length 38.4
  Top Layer w0.254: U27.15 16.87,89.89 14.86,87.88 v1(14.86,82.68) ; R12.2 1.66,75.7 v1(1.65,75.69)
  Top Layer w0.4: v1(1.65,75.69) 1.65,74.86 C16.2
  Bottom Layer w0.254: v1(14.86,82.68) 14.8,82.61 D6.2 3.56,72.14 1.65,74.04 v1(1.65,75.69)
GPIO4: length 55.2
  Top Layer w0.254: v1(6.22,73.41) 6.23,73.41 F6.2 ; U27.3 3.51,91.39 v1(3.56,91.44)
  Bottom Layer w0.254: v1(6.22,73.41) 4.19,73.41 3.56,74.04 3.56,79.25 1.91,79.25 ; H1.3 16.76,68.07 1.65,68.07 0.63,69.09 0.63,77.98 1.91,79.25 ; 1.91,79.25 1.4,79.76 1.4,86.61 4.01,89.23 4.01,90.98 v1(3.56,91.44)
GPIO9: length 20.4
  Top Layer w0.254: v1(5.08,83.95) 1.85,83.95 U27.8 ; R61.2 20.78,81.53 14.6,81.53 12.19,83.95 v1(7.24,83.95)
  Bottom Layer w0.254: v1(5.08,83.95) v1(7.24,83.95)
RTS: length 7.4
  Top Layer w0.254: Q1.2 26.02,81.21 29.21,84.41 F2.1 29.73,84.19 U1.24
U0RXD: length 2.1
  Top Layer w0.254: U27.11 20.58,83.89 R62.2
U0TXD: length 2.2
  Top Layer w0.254: U27.12 20.35,85.39 R63.2
USB_DN: length 17.7
  Top Layer w0.254: v1(35.18,91.57) 35.18,91.15 35.04,91.01 USBC1.B7 35.05,90.22 35.05,89.41 34.41,88.76 D3.2 34.04,90.23 USBC1.A7 ; U1.5 33.65,80.78 v1(34.04,80.39)
  Bottom Layer w0.254: v1(34.04,80.39) 34.04,90.42 v1(35.18,91.57)
USB_DP: length 18.5
  Top Layer w0.254: v1(33.27,80.26) 33.15,80.39 U1.4 ; v1(33.91,91.82) 33.91,91.46 33.76,91.31 ; 33.76,91.31 33.53,91.08 33.53,90.25 USBC1.B6 33.53,90.22 33.53,89.03 33.26,88.76 D4.2 ; 33.76,91.31 34.29,91.31 34.54,91.06 USBC1.A6
  Bottom Layer w0.254: v1(33.27,80.26) 33.27,91.19 v1(33.91,91.82)
$1N9728: length 2.7
  Top Layer w0.254: R2.1 31.5,89.03 31.75,89.28 32.36,89.28 32.54,89.46 USBC1.B5
$1N9740: length 2
  Top Layer w0.254: R1.1 35.54,88.55 USBC1.A5
$1N10217: length 1.5
  Top Layer w0.254: R60.1 23,80.01 Q1.3
$1N10218: length 4.3
  Top Layer w0.254: Q2.3 24.15,81.93 23.49,81.28 R61.1
$1N10219: length 3.4
  Top Layer w0.254: Q1.1 25.35,79.31 F1.2
$1N10220: length 5.1
  Top Layer w0.254: Q2.1 28.32,84.92 28.32,85.98 28.57,86.22 F2.2
$1N12006: length 9.9
  Top Layer w0.254: U1.25 29.46,83.69 v1(29.34,83.57) ; R63.1 v1(22.86,84.58)
  Bottom Layer w0.254: v1(29.34,83.57) 27.56,85.34 26.92,85.34 26.16,84.58 v1(22.86,84.58)
$1N12008: length 9.7
  Top Layer w0.254: U1.26 30.11,83.19 v1(29.84,82.93) ; R62.1 v1(22.86,83.31)
  Bottom Layer w0.254: v1(22.86,83.31) 26.29,83.31 27.51,82.09 29.01,82.09 v1(29.84,82.93)
$1N12116: length 1.8
  Top Layer w0.254: U1.11 36.97,83.69 F9.1
$1N12435: length 11
  Top Layer w0.254: v1(36.19,81.79) 35.79,82.19 U1.8 ; C10.2 36.71,79.57 R8.2 36.96,78.89 v1(36.46,78.39) ; 36.65,85.37 36.45,85.16 v1(36.45,84.71)
  Bottom Layer w0.254: v1(36.46,78.39) 36.46,81.52 v1(36.19,81.79) 36.45,82.04 v1(36.45,84.71)
$1N12546: length 1.9
  Top Layer w0.254: R9.2 36.82,82.69 U1.9
$1N16421: length 2.1
  Top Layer w0.254: U7.5 12.41,80.26 C15.1
$1N16436: length 4.2
  Top Layer w0.254: U7.7 11.12,77.34 R10.1 10.92,75.32 R11.1
$1N16545: length 9.4
  Top Layer w0.254: 18.2,78.61 19.3,78.61 19.56,78.36 19.56,76.96 19.3,76.71 16.29,76.71 14.87,75.28 F5.1
$1N16696: length 10.5
  Top Layer w0.4: F5.2 16.37,73.29 H1.2 20.45,69.79 D6.1
$1N16851: length 9.5
  Top Layer w0.254: 18.2,77.34 15.62,77.34 14.35,78.61 U7.6 12.59,78.41 10.92,78.41 10.81,78.3 C17.1
$1N49000: length 1.5
  Top Layer w0.254: R57.2 25.37,71.01 U25.2
$1N49009: length 5.4
  Top Layer w0.254: 32.15,75.31 C48.1 ; 32.15,75.31 32.14,75.3 R59.1 ; 32.15,75.31 29.82,75.31 29.59,75.54 U24.5
$1N49011: length 8.4
  Top Layer w0.254: 30.54,73.91 30.54,73.34 30.99,72.9 32.64,72.9 32.89,73.15 32.89,74.42 33.15,74.68 33.51,74.68 33.66,74.82 33.66,76.87 33.3,77.22 Q10.5
$1N49012: length 4.8
  Top Layer w0.254: U24.1 27.81,74.74 27.81,77.34 27.52,77.64 Q10.4
$1N49015: length 5.4
  Top Layer w0.254: U24.2 29.59,73.15 29.34,72.9 28.07,72.9 27.81,73.15 27.81,74.04 26.6,75.26 R58.1

## Copper pours and planes (outline as drawn; the poured copper is in the pictures)
GND on Top Layer: -0.25,97.16 40.51,97.16 40.51,66.42 -0.25,66.42
GND on Bottom Layer: -0.64,97.41 40.26,97.41 40.26,66.67 -0.64,66.67

## Text on the board
Bottom Silkscreen Layer: https://github.com/MohammedMMC | Made with Love By: | MohammedMMc | V1
